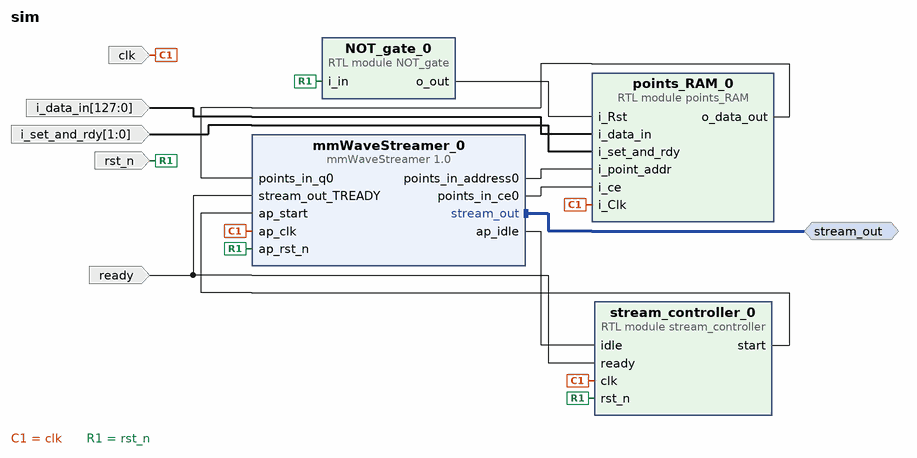
[diagram p0: block diagram of the top level]
# Vivado block design sim, xczu3eg-sbva484-1-i, Vivado 2020.2
create_bd_design sim

create_bd_intf_port -mode Master -vlnv xilinx.com:interface:axis_rtl:1.0 stream_out
create_bd_port -dir I -type clk clk
set_property -dict {CONFIG.ASSOCIATED_BUSIF stream_out} [get_bd_ports clk]
create_bd_port -dir I rst_n
create_bd_port -dir I -from 127 -to 0 i_data_in
create_bd_port -dir I -from 1 -to 0 i_set_and_rdy
create_bd_port -dir I ready

create_bd_cell -type module -reference stream_controller stream_controller_0
create_bd_cell -type module -reference points_RAM points_RAM_0
create_bd_cell -type ip -vlnv xilinx.com:hls:mmWaveStreamer:1.0 mmWaveStreamer_0
create_bd_cell -type module -reference NOT_gate NOT_gate_0

# ---- connections ----

connect_bd_intf_net [get_bd_intf_ports stream_out] [get_bd_intf_pins mmWaveStreamer_0/stream_out]
connect_bd_net [get_bd_pins points_RAM_0/o_data_out] [get_bd_pins mmWaveStreamer_0/points_in_q0]
connect_bd_net -net clk_0_1 [get_bd_ports clk] \
  [get_bd_pins stream_controller_0/clk] [get_bd_pins mmWaveStreamer_0/ap_clk] [get_bd_pins points_RAM_0/i_Clk]
connect_bd_net -net i_in_0_1 [get_bd_ports rst_n] \
  [get_bd_pins NOT_gate_0/i_in] [get_bd_pins mmWaveStreamer_0/ap_rst_n] [get_bd_pins stream_controller_0/rst_n]
connect_bd_net [get_bd_pins NOT_gate_0/o_out] [get_bd_pins points_RAM_0/i_Rst]
connect_bd_net -net i_data_in_0_1 [get_bd_ports i_data_in] [get_bd_pins points_RAM_0/i_data_in]
connect_bd_net [get_bd_pins mmWaveStreamer_0/points_in_address0] [get_bd_pins points_RAM_0/i_point_addr]
connect_bd_net [get_bd_pins mmWaveStreamer_0/points_in_ce0] [get_bd_pins points_RAM_0/i_ce]
connect_bd_net -net i_set_and_rdy_0_1 [get_bd_ports i_set_and_rdy] [get_bd_pins points_RAM_0/i_set_and_rdy]
connect_bd_net -net ready_0_1 [get_bd_ports ready] [get_bd_pins stream_controller_0/ready] [get_bd_pins mmWaveStreamer_0/stream_out_TREADY]
connect_bd_net [get_bd_pins stream_controller_0/start] [get_bd_pins mmWaveStreamer_0/ap_start]
connect_bd_net [get_bd_pins mmWaveStreamer_0/ap_idle] [get_bd_pins stream_controller_0/idle]

validate_bd_design
save_bd_design
